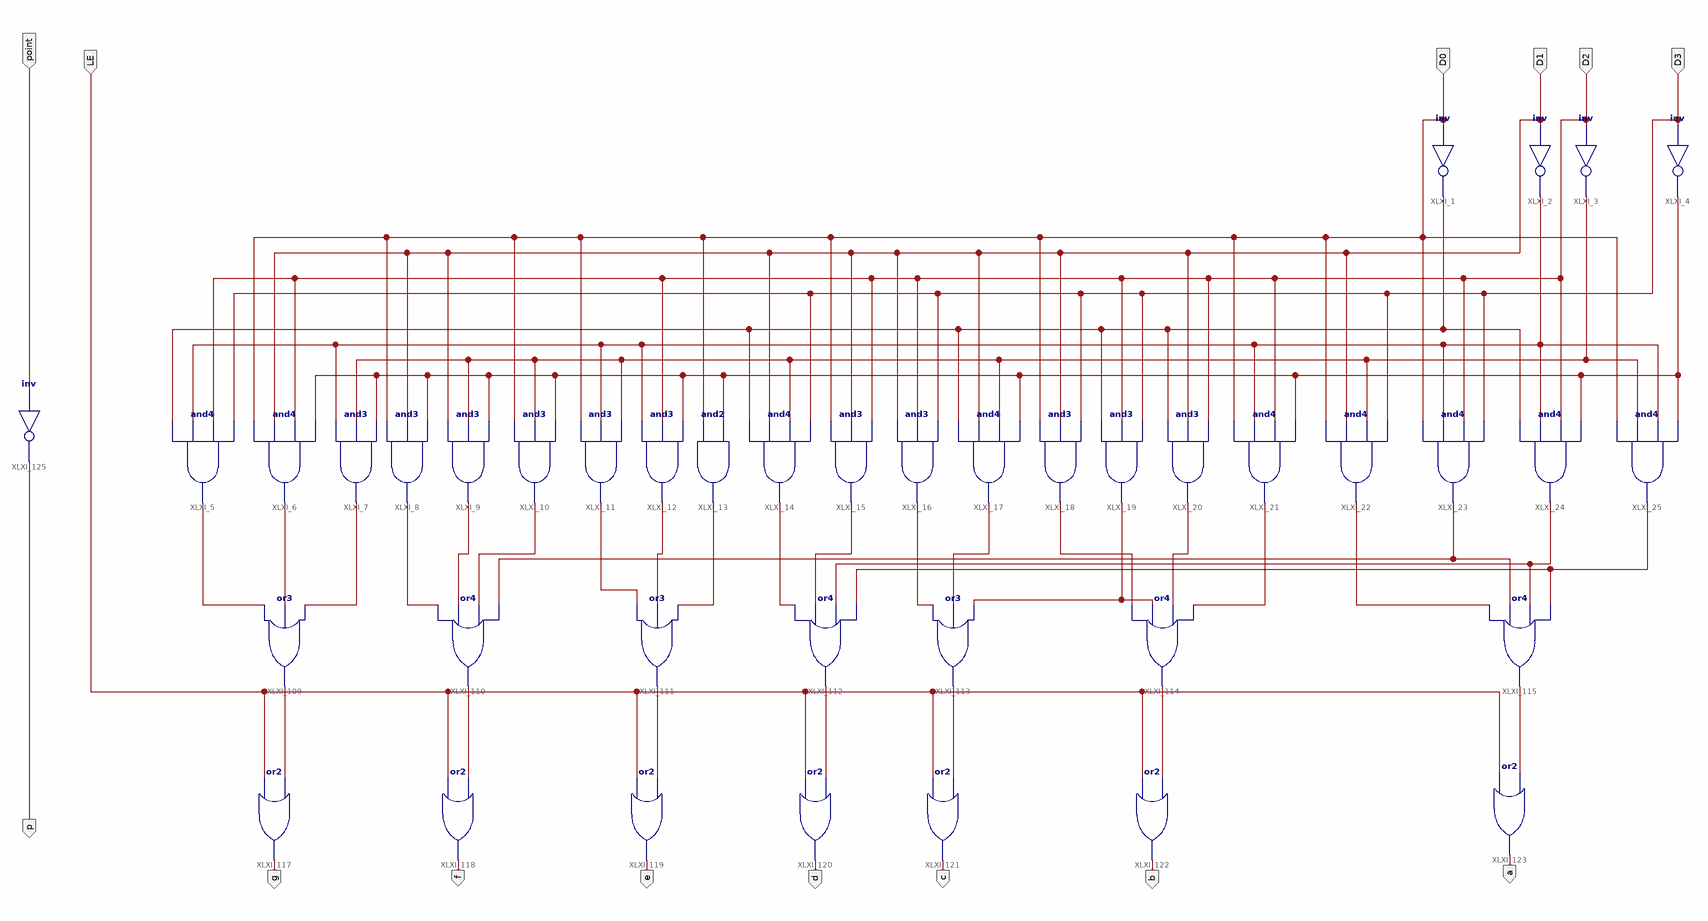
[diagram p0: schematic sheet 1]
// Xilinx ISE schematic MC14495_ZJU.sch (kintex7) as structural Verilog: 40 symbols, 14 ports
module MC14495_ZJU (
  input  D2,
  input  D1,
  input  D3,
  input  D0,
  input  point,
  input  LE,
  output p,
  output a,
  output b,
  output c,
  output d,
  output e,
  output f,
  output g
);

  wire XLXN_3, XLXN_4, XLXN_5, XLXN_6, XLXN_26, XLXN_28, XLXN_29, XLXN_30, XLXN_31, XLXN_32, XLXN_33,
       XLXN_34, XLXN_36, XLXN_37, XLXN_38, XLXN_40, XLXN_41, XLXN_42, XLXN_43, XLXN_44, XLXN_45, XLXN_46,
       XLXN_47, XLXN_48, XLXN_49, XLXN_51, XLXN_52, XLXN_53, XLXN_54, XLXN_55, XLXN_56, XLXN_57;

  and XLXI_10 (XLXN_32, D0, XLXN_5, XLXN_6);
  and XLXI_18 (XLXN_46, D0, D1, D3);
  and XLXI_19 (XLXN_45, XLXN_3, D2, D3);
  and XLXI_20 (XLXN_47, XLXN_3, D1, D2);
  and XLXI_25 (XLXN_42, D0, XLXN_5, XLXN_4, XLXN_6);
  and XLXI_24 (XLXN_41, XLXN_3, XLXN_4, D2, XLXN_6);
  and XLXI_23 (XLXN_33, D0, XLXN_4, D2, D3);
  and XLXI_22 (XLXN_49, D0, D1, XLXN_5, D3);
  and XLXI_21 (XLXN_48, D0, XLXN_4, D2, XLXN_6);
  and XLXI_17 (XLXN_44, XLXN_3, D1, XLXN_5, XLXN_6);
  and XLXI_16 (XLXN_43, D1, D2, D3);
  and XLXI_15 (XLXN_40, D0, D1, D2);
  and XLXI_14 (XLXN_38, XLXN_3, D1, XLXN_5, D3);
  and XLXI_13 (XLXN_37, D0, XLXN_6);
  and XLXI_12 (XLXN_36, XLXN_4, D2, XLXN_6);
  and XLXI_11 (XLXN_34, D0, XLXN_4, XLXN_5);
  and XLXI_9 (XLXN_31, D1, XLXN_5, XLXN_6);
  and XLXI_8 (XLXN_30, D0, D1, XLXN_6);
  and XLXI_7 (XLXN_29, XLXN_4, XLXN_5, XLXN_6);
  and XLXI_6 (XLXN_28, D0, D1, D2, XLXN_6);
  and XLXI_5 (XLXN_26, XLXN_3, XLXN_4, D2, D3);
  not XLXI_1 (XLXN_3, D0);
  not XLXI_2 (XLXN_4, D1);
  not XLXI_3 (XLXN_5, D2);
  not XLXI_4 (XLXN_6, D3);
  or XLXI_109 (XLXN_51, XLXN_26, XLXN_28, XLXN_29);
  or XLXI_110 (XLXN_52, XLXN_30, XLXN_31, XLXN_32, XLXN_33);
  or XLXI_111 (XLXN_53, XLXN_34, XLXN_36, XLXN_37);
  or XLXI_112 (XLXN_54, XLXN_38, XLXN_40, XLXN_41, XLXN_42);
  or XLXI_113 (XLXN_55, XLXN_43, XLXN_44, XLXN_45);
  or XLXI_114 (XLXN_56, XLXN_46, XLXN_45, XLXN_47, XLXN_48);
  or XLXI_115 (XLXN_57, XLXN_49, XLXN_33, XLXN_41, XLXN_42);
  or XLXI_117 (g, LE, XLXN_51);
  or XLXI_118 (f, LE, XLXN_52);
  or XLXI_119 (e, LE, XLXN_53);
  or XLXI_120 (d, LE, XLXN_54);
  or XLXI_121 (c, LE, XLXN_55);
  or XLXI_122 (b, LE, XLXN_56);
  or XLXI_123 (a, LE, XLXN_57);
  not XLXI_125 (p, point);
endmodule
